# EAGLE board IoT_pj_schematic (EAGLE 9.6.1)
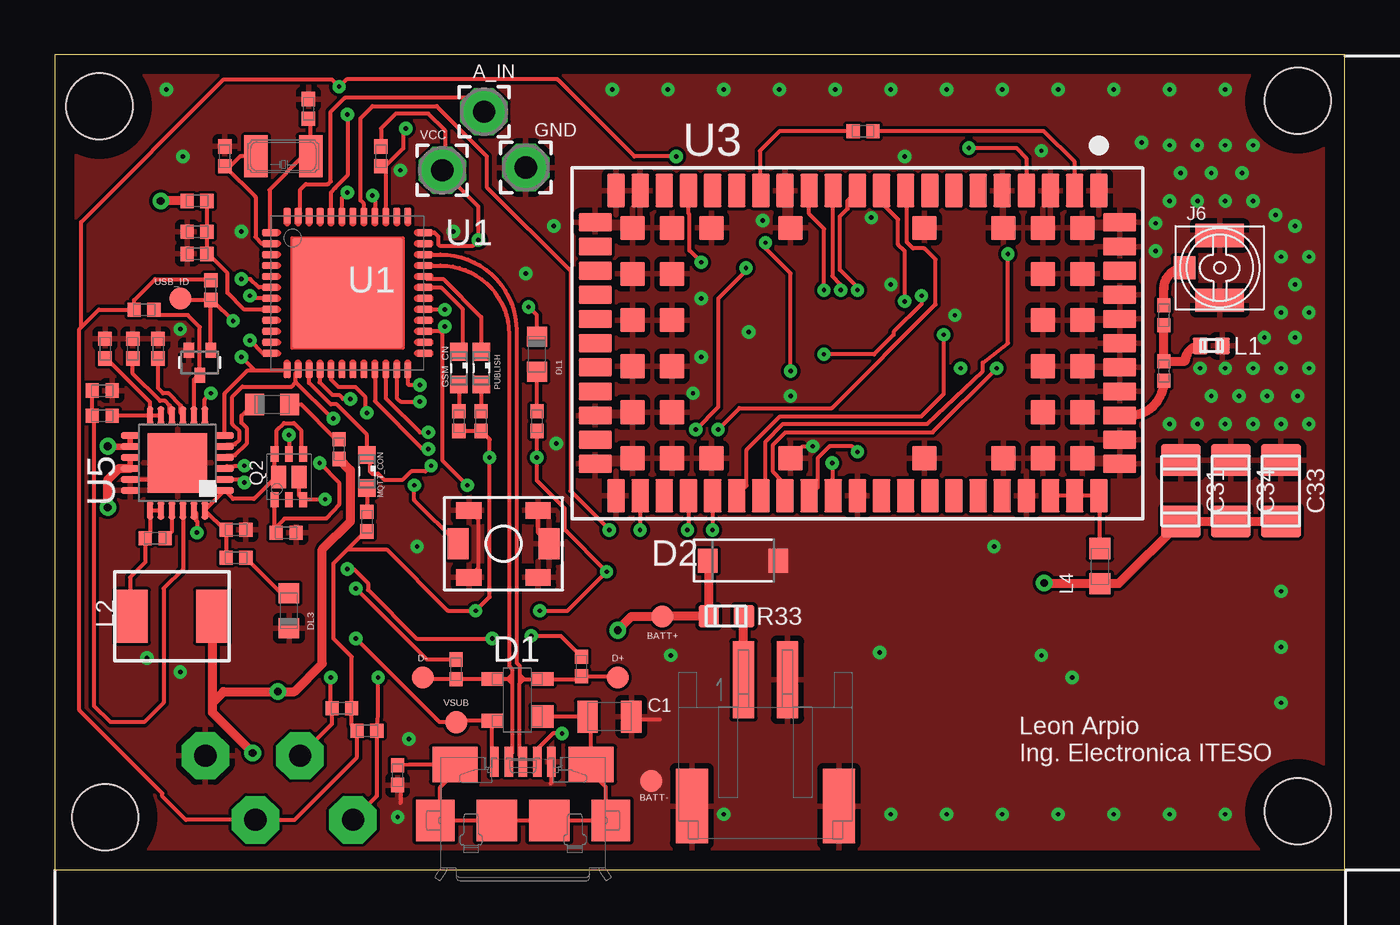
[diagram p2: board, top side]
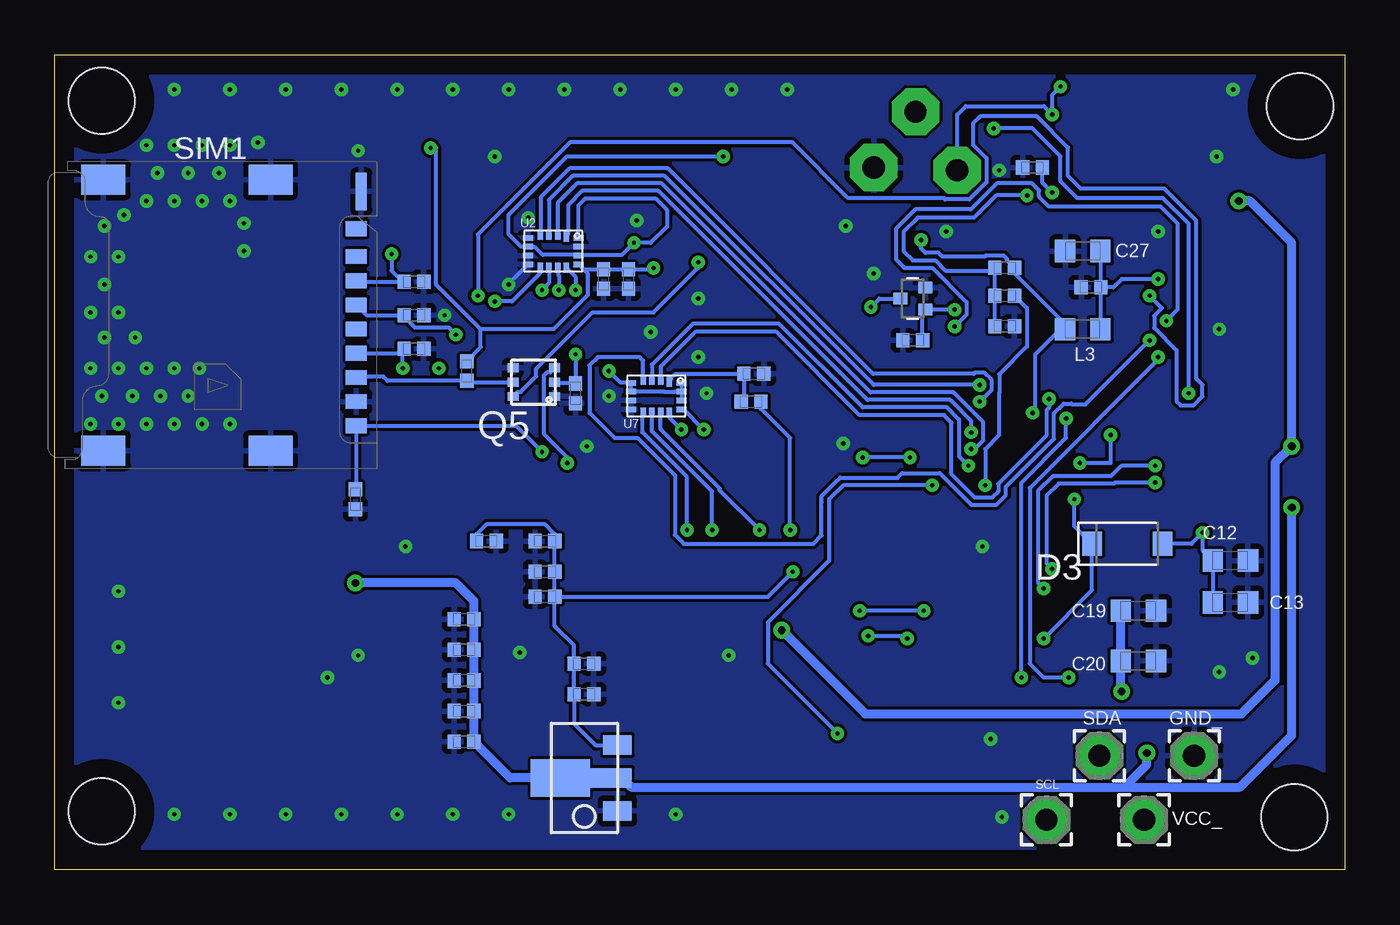
[diagram p3: board, bottom side, seen from below]

Size 58.78 x 37.13 mm. Coordinates in mm from the lower left corner, seen from the top.
Outline: 0,0 58.78,0 58.78,37.13 0,37.13 0,0
Copper layers (1*16): Top 0.035mm / dielectric 0.2mm / Bottom 0.035mm
Design rules "default *": minimum track width 6mil, minimum drill 0.195mm, track to track 5.5mil, track to pad 5.5mil, pad to pad 5.5mil, via to via 5.5mil, smd to smd 5.5mil, copper to edge 35mil, drill to drill 6mil, minimum pad ring 10mil, minimum via ring 8mil, stop-mask expansion 4mil, vias tented up to drill 0mil, thermal gap 10mil
Net classes: 0 default: width 0.19 mm, drill 0.19 mm; 1 usb: width 0.19 mm, drill 0.19 mm, clearance 0.127 mm
Holes 3 mm at 56.64,35.05 56.64,2.67 2.29,2.41 2.03,34.8

## Footprints (pad centres in the part's own frame; a part is rotated, then mirrored left to right if it is on the bottom)
2,15/1,0 = drill 1.016 pad 2.159 octagon: 1 0,0
TP-1.00MM = smd 1 x 1 bottom: X 0,0
0805-R2013X50N = smd 0.95 x 1.45: 1 -1,0; 2 1,0
0402-1005X55N = smd 0.62 x 0.62: 1 -0.45,0; 2 0.45,0
0603-1608X90N = smd 0.95 x 1: 1 -0.8,0; 2 0.8,0
C1206 = smd 1.45 x 1.8: 1 -1.4,0; 2 1.4,0
SOT190P230X110-4N = smd 1 x 1: 1 -1.15,0.75 | smd 1 x 0.6: 2 -1.15,-0.95; 3 1.15,-0.95; 4 1.15,0.95
SODFL3517X110N = smd 0.91 x 1.07: A 1.605,0; C -1.605,0
LEDC1608X80N-AK = smd 0.9 x 0.95: A 0.8,0; C -0.8,0
SML0603 = smd 0.8 x 0.8: A 0.75,0; C -0.75,0
ZX62-AB-5PA = smd 0.4 x 1.35: 1 -1.3,3.025; 2 -0.65,3.025; 3 0,3.025; 4 0.65,3.025; 5 1.3,3.025 | smd 2.1 x 1.6: 6 3.1,2.9; 11 -3.1,2.9 | smd 1.8 x 1.9: 7 4,0.35; 10 -4,0.35 | smd 1.9 x 1.9: 8 1.2,0.35; 9 -1.2,0.35
U.FL-R-SMT-1(60) = smd 1.05 x 2.2: GND1 -1.475,0; GND2 1.475,0 | smd 1.05 x 1: SIG 0,-1.6
JST-S2B-PH-SM4-TB = smd 1 x 3.5: 1 -1,2.95; 2 1,2.95 | smd 1.5 x 3.4: 3 3.35,-2.8; 4 -3.35,-2.8
C0402 = smd 0.7 x 0.75: 1 -0.5,0; 2 0.5,0
SRP4020 = smd 1.5 x 2.4: 1 -1.85,0; 2 1.85,0
C&K_PTS820_NO_HOLES = smd 1.15 x 0.75: 1 -1.575,1.525; 2 -1.575,-1.525; 3 1.575,1.525; 4 1.575,-1.525 | smd 0.95 x 1.4: 5 -2.075,0; 6 2.075,0
SOTFL50P160X78-3 = smd 0.5 x 0.66: D 0,0.57; G -0.5,-0.57; S 0.5,-0.57
SON65P205X205X75-8N-MWSD = smd 0.67 x 0.37: A 1.04,-0.65; D 1.04,0.65; G -1.04,0; K -1.04,-0.65; NC 1.04,0; S -1.04,0.65 | smd 1 x 0.7: D2 0,0.467; K2 0,-0.467
PWR_SC70-6L2 = smd 0.4 x 0.5: 1 -0.65,-0.95; 2 0,-0.95; 3 0.65,-0.95; 4 0.65,0.95; 5 0,0.95; 6 -0.65,0.95
C0603 = smd 0.95 x 1: 1 -0.8,0; 2 0.8,0
MICROSIM8 = smd 0.67 x 0.95: CLK -0.47,6.77; GND 3.93,6.77; IO -1.57,6.77; NC1 -2.67,6.77; NC2 -3.94,6.77; RST 1.73,6.77; SW 2.83,6.77; VCC 5.03,6.77; VPP 0.63,6.77 | smd 1.7 x 0.5: SH1 -5.64,6.995 | smd 1.35 x 2: SH2 -6.175,2.865; SH3 6.175,2.865; SH4 -6.175,-4.755; SH5 6.175,-4.755
QFN50P700X700X90-49XN-EPSQ515 = smd 0.65 x 0.28: 1 -3.525,2.75; 2 -3.525,2.25; 3 -3.525,1.75; 4 -3.525,1.25; 5 -3.525,0.75; 6 -3.525,0.25; 7 -3.525,-0.25; 8 -3.525,-0.75; 9 -3.525,-1.25; 10 -3.525,-1.75; 11 -3.525,-2.25; 12 -3.525,-2.75; 25 3.525,-2.75; 26 3.525,-2.25; 27 3.525,-1.75; 28 3.525,-1.25; 29 3.525,-0.75; 30 3.525,-0.25; 31 3.525,0.25; 32 3.525,0.75; 33 3.525,1.25; 34 3.525,1.75; 35 3.525,2.25; 36 3.525,2.75 | smd 0.28 x 0.65: 13 -2.75,-3.525; 14 -2.25,-3.525; 15 -1.75,-3.525; 16 -1.25,-3.525; 17 -0.75,-3.525; 18 -0.25,-3.525; 19 0.25,-3.525; 20 0.75,-3.525; 21 1.25,-3.525; 22 1.75,-3.525; 23 2.25,-3.525; 24 2.75,-3.525; 37 2.75,3.525; 38 2.25,3.525; 39 1.75,3.525; 40 1.25,3.525; 41 0.75,3.525; 42 0.25,3.525; 43 -0.25,3.525; 44 -0.75,3.525; 45 -1.25,3.525; 46 -1.75,3.525; 47 -2.25,3.525; 48 -2.75,3.525 | smd 5 x 5: 49 0,0
RSV = smd 0.25 x 0.55: 1 -0.6,-0.7 | smd 0.25 x 0.45: 2 -0.2,-0.75; 3 0.2,-0.75; 4 0.6,-0.75; 9 0.6,0.75; 10 0.2,0.75; 11 -0.2,0.75; 12 -0.6,0.75 | smd 0.45 x 0.25: 5 1.15,-0.6; 6 1.15,-0.2; 7 1.15,0.2; 8 1.15,0.6; 13 -1.15,0.6; 14 -1.15,0.2; 15 -1.15,-0.2; 16 -1.15,-0.6
SARA-96 = smd 1.5 x 0.8: 1 -6.95,11; 2 -6.95,9.9; 3 -6.95,8.8; 4 -6.95,7.7; 5 -6.95,6.6; 6 -6.95,5.5; 7 -6.95,4.4; 8 -6.95,3.3; 9 -6.95,2.2; 10 -6.95,1.1; 11 -6.95,0; 12 -6.95,-1.1; 13 -6.95,-2.2; 14 -6.95,-3.3; 15 -6.95,-4.4; 16 -6.95,-5.5; 17 -6.95,-6.6; 18 -6.95,-7.7; 19 -6.95,-8.8; 20 -6.95,-9.9; 21 -6.95,-11; 33 6.95,-11; 34 6.95,-9.9; 35 6.95,-8.8; 36 6.95,-7.7; 37 6.95,-6.6; 38 6.95,-5.5; 39 6.95,-4.4; 40 6.95,-3.3; 41 6.95,-2.2; 42 6.95,-1.1; 43 6.95,0; 44 6.95,1.1; 45 6.95,2.2; 46 6.95,3.3; 47 6.95,4.4; 48 6.95,5.5; 49 6.95,6.6; 50 6.95,7.7; 51 6.95,8.8; 52 6.95,9.9; 53 6.95,11 | smd 0.8 x 1.5: 22 -5.5,-11.95; 23 -4.4,-11.95; 24 -3.3,-11.95; 25 -2.2,-11.95; 26 -1.1,-11.95; 27 0,-11.95; 28 1.1,-11.95; 29 2.2,-11.95; 30 3.3,-11.95; 31 4.4,-11.95; 32 5.5,-11.95; 54 5.5,11.95; 55 4.4,11.95; 56 3.3,11.95; 57 2.2,11.95; 58 1.1,11.95; 59 0,11.95; 60 -1.1,11.95; 61 -2.2,11.95; 62 -3.3,11.95; 63 -4.4,11.95; 64 -5.5,11.95 | smd 1.1 x 1.1: 65 -5.25,10.25; 66 -3.15,10.25; 67 -1.05,10.25; 68 1.05,10.25; 69 3.15,10.25; 70 5.25,10.25; 71 -5.25,8.45; 72 -3.15,8.45; 73 -1.05,8.45; 74 1.05,8.45; 75 3.15,8.45; 76 5.25,8.45; 77 -5.25,6.65; 78 5.25,6.65; 79 -5.25,3.05; 80 5.25,3.05; 81 -5.25,-3.05; 82 5.25,-3.05; 83 -5.25,-6.65; 84 5.25,-6.65; 85 -5.25,-8.45; 86 -3.15,-8.45; 87 -1.05,-8.45; 88 1.05,-8.45; 89 3.15,-8.45; 90 5.25,-8.45; 91 -5.25,-10.25; 92 -3.15,-10.25; 93 -1.05,-10.25; 94 1.05,-10.25; 95 3.15,-10.25; 96 5.25,-10.25
QFN24 = smd 0.3 x 0.85: 1 1.25,2.155; 2 0.75,2.155; 3 0.25,2.155; 4 -0.25,2.155; 5 -0.75,2.155; 6 -1.25,2.155; 13 -1.25,-2.155; 14 -0.75,-2.155; 15 -0.25,-2.155; 16 0.25,-2.155; 17 0.75,-2.155; 18 1.25,-2.155 | smd 0.85 x 0.3: 7 -2.155,1.25; 8 -2.155,0.75; 9 -2.155,0.25; 10 -2.155,-0.25; 11 -2.155,-0.75; 12 -2.155,-1.25; 19 2.155,-1.25; 20 2.155,-0.75; 21 2.155,-0.25; 22 2.155,0.25; 23 2.155,0.75; 24 2.155,1.25 | smd 2.7 x 2.7: 25 0,0
SOT89-3L = smd 0.9 x 1.3: 1 -1.5,0; 3 1.5,0 | smd 0.9 x 1.9: 2 0,0.3 | smd 1.7 x 2.7: TH 0,2.6
ABS07 = smd 1.1 x 1.9: 1 -1.25,0; 2 1.25,0

## Placement (x,y rotation side)
A_IN  [2,15/1,0]  19.56,34.54 0 top
BATT+  DNP  [TP-1.00MM]  27.69,11.56 0 bottom
BATT-  DNP  [TP-1.00MM]  27.18,4.06 0 bottom
C1  4n7  [0805-R2013X50N]  25.27,6.99 0 top
C2  100n  [0402-1005X55N]  15.49,24.77 0 bottom
C3  20p  [0402-1005X55N]  11.56,34.67 270 top
C4  20p  [0402-1005X55N]  7.75,32.51 270 top
C6  100n  [0402-1005X55N]  6.48,28.07 180 top
C8  100n  [0402-1005X55N]  36.45,12.45 0 bottom
C9  100n  [0402-1005X55N]  33.78,26.92 270 bottom
C10  15p  [0402-1005X55N]  50.55,22.73 90 top
C11  33p  [0402-1005X55N]  50.55,25.27 90 top
C12  10u  [0603-1608X90N]  5.21,14.1 0 bottom
C13  10u  [0603-1608X90N]  5.21,12.19 0 bottom
C14  1u  [0402-1005X55N]  8.26,15.49 0 top
C15  47n  [0402-1005X55N]  4.57,15.11 180 top
C16  4u7  [0402-1005X55N]  2.16,21.84 0 top
C17  100n  [0402-1005X55N]  34.67,8 0 bottom
C18  100n  [0402-1005X55N]  34.67,9.4 0 bottom
C19  10u  [0603-1608X90N]  9.4,11.81 0 bottom
C20  10u  [0603-1608X90N]  9.4,9.53 0 bottom
C22  1u  [0402-1005X55N]  40.13,7.24 180 bottom
C23  100n  [0402-1005X55N]  11.56,26.54 180 bottom
C24  100n  [0402-1005X55N]  39.12,14.99 0 bottom
C25  1u  [0402-1005X55N]  14.22,32 180 bottom
C26  1u  [0402-1005X55N]  36.45,14.99 180 bottom
C27  4u7  [0603-1608X90N]  11.94,28.19 180 bottom
C28  10n  [0402-1005X55N]  40.13,8.64 180 bottom
C29  100n  [0402-1005X55N]  40.13,11.43 180 bottom
C30  15p  [0402-1005X55N]  40.13,5.84 180 bottom
C31  100uF  [C1206]  51.31,17.27 90 top
C32  100n  [0402-1005X55N]  45.09,16.89 90 bottom
C33  100uF  [C1206]  55.88,17.27 90 top
C34  100uF  [C1206]  53.59,17.27 90 top
C35  100n  [0402-1005X55N]  36.45,13.59 0 bottom
C36  100n  [0402-1005X55N]  32.64,26.92 270 bottom
C37  56p  [0402-1005X55N]  40.13,10.03 180 bottom
D1  PRTR5V  [SOT190P230X110-4N]  21.08,7.75 180 top
D2  PMEG6020  [SODFL3517X110N]  31.37,14.1 0 top
D3  PMEG6020  [SODFL3517X110N]  9.91,14.86 0 bottom
D4  PESD0402  [0402-1005X55N]  42.42,23.75 180 bottom
D5  PESD0402  [0402-1005X55N]  42.42,25.27 180 bottom
D6  PESD0402  [0402-1005X55N]  42.42,26.8 180 bottom
D+  DNP  [TP-1.00MM]  25.65,8.76 0 bottom
D-  DNP  [TP-1.00MM]  16.76,8.76 0 bottom
DL1  YELLOW  [LEDC1608X80N-AK]  21.97,23.5 270 top
DL2  ORANGE  [LEDC1608X80N-AK]  9.91,21.21 0 top
DL3  GREEN  [LEDC1608X80N-AK]  10.67,11.81 90 top
GND  [2,15/1,0]  21.46,32 0 top
GND_  [2,15/1,0]  6.86,5.21 0 bottom
GSM_CN  [SML0603]  18.41,22.86 270 top
J1  -  [ZX62-AB-5PA]  21.34,1.91 0 top
J6  -  [U.FL-R-SMT-1(60)]  53.09,27.43 270 top
J7  -  [JST-S2B-PH-SM4-TB]  32.38,5.71 0 top
L1  39nH  [C0402]  52.7,23.88 180 top
L2  2u2  [SRP4020]  5.33,11.56 0 top
L3  BLM18PG471  [0603-1608X90N]  11.94,24.64 0 bottom
L4  BLM18EG221  [0603-1608X90N]  47.62,13.84 90 top
MQTT_CON  [SML0603]  14.22,18.16 270 top
PB1  PTS820  [C&K_PTS820_NO_HOLES]  20.45,14.86 180 top
PUBLISH  [SML0603]  19.43,22.86 270 top
Q1  2N7002  [SOTFL50P160X78-3]  19.68,26.04 90 bottom
Q2  SIA817  [SON65P205X205X75-8N-MWSD]  10.67,17.91 270 top
Q3  2N7002  [SOTFL50P160X78-3]  6.6,23.11 180 top
Q5  2N7002DW-7-FNO_PAD  [PWR_SC70-6L2]  36.96,22.23 90 bottom
R1  1M  [0402-1005X55N]  15.62,4.32 90 top
R2  1k  [0402-1005X55N]  19.43,20.45 90 top
R3  330R  [0402-1005X55N]  15.49,26.16 180 bottom
R4  1k  [0402-1005X55N]  14.22,15.88 90 top
R5  10k  [0402-1005X55N]  15.49,27.43 0 bottom
R6  1k  [0402-1005X55N]  18.41,20.45 90 top
R7  DNP  [0402-1005X55N]  24,9.27 90 top
R8  330k  [0402-1005X55N]  6.48,30.48 180 top
R9  1M2  [0402-1005X55N]  6.48,29.08 0 top
R10  100k  [0402-1005X55N]  35.05,21.72 90 bottom
R11  0R  [0402-1005X55N]  27.05,21.34 0 bottom
R12  100k  [0402-1005X55N]  36.83,33.66 0 top
R13  4k7  [0402-1005X55N]  14.22,6.35 180 top
R14  4k7  [0402-1005X55N]  13.08,7.37 0 top
R15  330R  [0402-1005X55N]  21.97,20.45 90 top
R16  100k  [0402-1005X55N]  19.68,24.13 0 bottom
R17  DNP  [0402-1005X55N]  18.29,9.14 90 top
R18  DNP  [0402-1005X55N]  26.92,22.61 180 bottom
R19  100k  [0402-1005X55N]  10.54,15.37 180 top
R21  10k  [0402-1005X55N]  7.11,26.42 270 top
R23  330R  [0402-1005X55N]  12.95,19.18 270 top
R24  10k  [0402-1005X55N]  14.86,32.51 270 top
R25  10k  [0402-1005X55N]  4.7,23.75 270 top
R26  10k  [0402-1005X55N]  4.06,25.53 0 top
R27  390R  [0402-1005X55N]  8.26,14.22 180 top
R28  220R  [0402-1005X55N]  3.56,23.75 90 top
R29  10k  [0402-1005X55N]  2.29,23.75 270 top
R30  5k49  [0402-1005X55N]  2.16,20.7 0 top
R31  10k  [0402-1005X55N]  40.01,22.73 90 bottom
R33  0R  [C0603]  30.61,11.56 180 top
SCL  [2,15/1,0]  13.59,2.29 0 bottom
SDA  [2,15/1,0]  11.18,5.21 0 bottom
SIM1  -  [MICROSIM8]  51.82,25.27 270 bottom
U1  D21G18  [QFN50P700X700X90-49XN-EPSQ515]  13.34,26.29 0 top
U2  SN74AVC4T774  [RSV]  36.07,28.19 180 bottom
U3  SARA-U201  [SARA-96]  36.58,24 270 top
U5  BQ24195L  [QFN24]  5.59,18.54 270 top
U6  AP721533  [SOT89-3L]  33.15,4.19 90 bottom
U7  SN74AVC4T774  [RSV]  31.37,21.59 180 bottom
USB_ID  DNP  [TP-1.00MM]  5.71,26.04 0 bottom
VCC  [2,15/1,0]  17.65,31.88 0 top
VCC_  [2,15/1,0]  9.14,2.29 0 bottom
VSUB  DNP  [TP-1.00MM]  18.29,6.73 0 bottom
Y1  32768Hz  [ABS07]  10.41,32.51 0 top

## Tracks (layer width: path | path; a pad name or v marks a point on that pad's centre or on a via)
+1V8  (via drill 0.2)
  Top 0.19: v31.5,27.43 31.5,27.3 30.23,26.04 30.23,21.08 v29.21,20.07 | v41.66,32.89 43.81,32.89 44.28,32.43 U3.4
  Bottom 0.19: v31.5,27.43 31.55,27.37 C36.1 C9.1 34.7,27.37 U2.13 34.5,27.18 34.5,26.19 36.05,24.64 39.37,24.64 | v29.21,20.07 30.13,20.99 U7.13 | 39.37,24.64 41.4,26.67 41.4,32.89 v41.66,32.89 | R31.2 39.37,23.82 39.37,24.64
+3V3  (via drill 0.2)
  Top 0.19: R4.1 14.15,15.43 13.34,14.61 | 13.34,14.61 12.7,13.97 12.7,10.54 13.53,9.71 R14.2 13.53,6.59 R13.2 13.77,5.14 10.92,2.29 VCC_.1 5.97,2.29 4.9,3.36 4.9,3.5 1.11,7.28 1.11,24.64 1.19,24.72 | 13.34,14.61 15.11,14.61 17.91,11.81 v19.18,11.81 19.81,12.45 v19.81,18.8 19.81,19.62 R2.1 R6.1 | R15.1 v21.97,18.8 21.97,17.73 23.24,16.46 23.24,15.49 v25.15,13.59 23.37,11.81 v22.1,11.81 | R21.1 7.05,26.92 4.57,26.92 3.61,25.97 R26.1 2,25.53 1.19,24.72 | R24.1 14.86,33.78 15.53,34.46 17.02,34.46 17.78,33.69 17.78,32 VCC.1 19.3,30.23 v19.3,28.7 19.05,28.45 17.53,28.45 17.47,28.5 17.47,28.87 17.3,29.04 U1.36 | v13.34,34.42 13.34,31.64 12.78,31.09 12.78,31.07 12.57,30.86 12.57,29.83 U1.44 | 1.19,24.72 1.19,29.51 7.7,36.02 12.62,36.02 v12.95,35.69 13.29,36.02 22.9,36.02 26.42,32.51 v28.32,32.51 | v33.53,22.73 33.53,27.18 32.38,28.32 v32.38,28.57 | U1.17 12.59,22.34 12.91,22.01 13.69,22.01 14.14,21.56 14.14,20.83 v14.22,20.83
  Bottom 0.19: C8.2 36,11.11 35.12,10.23 C18.1 C17.1 35.12,6.67 34.14,5.69 U6.3 | C8.2 C35.2 C26.1 36,15.3 36.45,15.75 39.12,15.75 39.57,15.3 C24.1 | C8.2 26.29,12.45 v25.15,13.59 | U7.16 U7.15 | U7.15 U7.14 | U7.15 30.52,21.79 30.54,21.77 31,21.77 31.02,21.79 U7.6 U7.5 32.55,22.23 33.02,22.23 v33.53,22.73 | 34.89,28.77 U2.16 34.92,30.28 34.6,30.6 31.41,30.6 30.89,30.07 30.89,29.31 31.62,28.57 v32.38,28.57 32.94,28.02 34.89,28.02 U2.14 34.95,28.02 36.55,28.02 36.89,28.37 37.19,28.37 U2.6 37.54,28.39 38.1,28.96 38.1,29.84 35.43,32.51 v28.32,32.51 | v19.81,18.8 v21.97,18.8 | VCC.1 17.65,34.42 17.27,34.8 13.72,34.8 v13.34,34.42 13.34,35.31 v12.95,35.69 | v19.18,11.81 v22.1,11.81 | v14.22,20.83 14.1,20.95 14.1,23.5 12.95,24.64 L3.1 12.74,24.87 15.04,27.18 R5.2 15.39,27.77 15.39,27.84 15.54,27.99 16.35,27.99 16.4,27.94 18.34,27.94 18.51,28.12 19.1,28.12 19.3,28.32 v19.3,28.7
+3V8  (via drill 0.35)
  Top 0.19: 45.12,13.04 v45.09,13.08 | U5.16
  Top 0.254: U5.16 U5.15
  Top 0.406: C33.1 C34.1 C31.1 48.48,13.04 L4.1 45.12,13.04 | v9.02,5.33 7.18,7.17 7.18,7.62 | 7.18,7.62 L2.2 | U5.16 2.93,18.3 2.41,17.78 v2.41,16.51 | 7.18,7.62 7.69,8.13 v10.16,8.13 10.92,8.13 12.19,9.4 12.19,14.61 13.46,15.88 13.46,18.22 R23.2
  Bottom 0.406: v45.09,13.08 40.51,13.08 39.68,12.25 C29.1 C37.1 C28.1 C22.1 C30.1 38.03,4.19 U6.TH U6.2 32.94,4.19 32.52,3.77 10.03,3.77 | 10.03,3.77 4.77,3.77 2.41,6.13 v2.41,16.51 | 10.03,3.77 9.02,4.79 v9.02,5.33 | v10.16,8.13 10.2,8.17 C20.1 C19.1
+5V  (via drill 0.2)
  Top 0.19: Q2.D2 11.13,17.05 Q2.D 12.29,16.87 v12.32,16.89 | J1.1 19.93,5.03 D1.4 18.35,6.8 VSUB.X 17.54,6.73 13.73,10.54 v13.72,10.54
  Bottom 0.19: v13.72,10.54 11.51,12.75 D3.C 12.32,15.67 v12.32,16.89
GND  (via drill 0.2)
  Top 0.19: C1.2 26.4,6.86 27.56,6.86 | R1.1 15.75,3.74 15.75,3.05 | PB1.5 22.02,15.36 PB1.2 | PB1.3 19.3,13.77 19.3,15.95 PB1.4 | U5.17 4.84,17.79 U5.25 | U3.82 34.08,19.3 v34.54,19.3 | J1.5 22.64,3.97 22.61,3.94
  Bottom 0.19: U2.8 38.1,26.71 v38.1,26.67
  other vias: 50.8,20.32 52.07,20.32 53.34,20.32 54.61,20.32 55.88,20.32 57.15,20.32 52.7,21.59 53.98,21.59 55.24,21.59 56.64,21.59 52.2,22.86 53.34,22.86 54.61,22.86 55.88,22.86 57.15,22.86 55.12,24.26 56.52,24.26 57.15,25.4 55.88,25.4 56.52,26.67 57.15,27.94 55.88,27.94 56.52,29.34 55.63,29.84 54.61,30.48 50.16,28.19 50.16,29.46 53.34,30.48 52.07,30.48 50.8,30.48 54.1,31.75 52.7,31.75 51.31,31.75 54.61,33.02 53.34,33.02 52.07,33.02 50.8,33.02 49.53,33.15 15.62,2.41 5.71,24.64 5.84,32.51 46.35,8.76 32.26,29.59 38.73,32.51 21.46,27.18 5.71,9.02 31.62,24.51 33.53,21.59 42.8,14.73 29.46,26.04 28.07,9.78 16.51,14.73 4.19,9.65 16.13,5.97 44.96,32.77 8.51,29.08 41.02,25.27 29.08,21.72 22.86,19.43 37.21,29.72 15.75,31.88 18.16,29.08 22.73,29.34 37.59,9.91 29.46,23.37 44.96,9.78 5.08,35.56 25.4,35.56 27.94,35.56 30.48,35.56 33.02,35.56 35.56,35.56 38.1,35.56 40.64,35.56 43.18,35.56 45.72,35.56 48.26,35.56 50.8,35.56 53.34,35.56 55.88,12.7 55.88,10.16 55.88,7.62 53.34,2.54 50.8,2.54 48.26,2.54 45.72,2.54 43.18,2.54 40.64,2.54 38.1,2.54 30.48,2.54
  pour Top: 0,0 58.8,0 58.8,37.08 0.13,37.08 0,37.08
  pour Bottom: 58.8,37.08 58.8,0 0,0 0,37.08
MCTS  (via drill 0.2)
  Top 0.19: v36.58,26.42 36.58,26.54 35.77,27.34 35.77,29.78 36.12,30.12 36.12,30.5 U3.11
  Bottom 0.19: U2.10 36.27,26.74 36.37,26.64 36.37,26.63 v36.58,26.42
MDTR  (via drill 0.2)
  Top 0.19: v30.23,20.07 31.2,21.04 35.41,21.04 40.13,25.76 40.13,27.81 39.62,28.32 39.12,28.32 38.83,28.61 38.83,30.9 U3.9
  Bottom 0.19: U7.12 30.77,20.61 v30.23,20.07
MI2SCLK  (via drill 0.2)
  Top 0.19: U3.36 28.88,15.54 v28.83,15.49
  Bottom 0.19: v28.83,15.49 28.83,17.25 31.57,19.99 U7.10
MI2SFS  (via drill 0.2)
  Top 0.19: U3.34 v26.68,15.5 v26.67,15.49
  Bottom 0.19: v26.67,15.49 28.49,17.31 28.49,17.39 31.17,20.07 U7.11
MI2SRX  (via drill 0.2)
  Top 0.19: U3.37 v29.98,15.5 v29.97,15.49
  Bottom 0.19: v29.97,15.49 29.97,17.91 32,19.94 32,20.8 U7.9
MRST  (via drill 0.2)
  Top 0.19: U3.18 28.88,29.92 28.92,29.87 28.92,28.23 v29.46,27.69
  Bottom 0.19: Q5.6 37.7,21.78 37.55,21.78 36.85,22.48 36.85,22.84 34.28,25.4 31.5,25.4 29.46,27.43 v29.46,27.69
MRTS  (via drill 0.2)
  Top 0.19: U3.10 37.72,30.91 37.72,30.35 38.43,29.64 38.43,28.5 38.73,28.19 v38.73,25.91
  Bottom 0.19: U2.9 36.67,27.19 37.95,25.91 v38.73,25.91
MRX  (via drill 0.2)
  Top 0.19: v35.05,26.42 35.05,29.21 34.38,29.89 U3.13
  Bottom 0.19: U2.12 35.05,27.03 v35.05,26.42
MTX  (via drill 0.2)
  Top 0.19: v35.81,26.42 35.81,26.67 35.43,27.05 35.43,30.91 U3.12
  Bottom 0.19: U2.11 35.84,27.42 35.84,27.12 35.81,27.09 v35.81,26.42
N17658775  (via drill 0.2)
  Top 0.19: PB1.6 16.38,16.85 v16.38,17.53
  Bottom 0.19: v16.38,17.53 16.38,19.18 15.75,19.81 15.75,21.72 15.74,21.73 15.74,22.59 14.48,23.86 14.48,25.6 R3.1
N17798864
  Top 0.19: DL2.A 11.21,21.21 12.8,19.63 R23.1
N17834267
  Top 0.19: R27.1 10.32,12.61 DL3.A
N17852357  (via drill 0.2)
  Top 0.19: U1.6 9.29,26.54 8.91,26.92 v8.51,26.92
  Bottom 0.19: v8.51,26.92 10.16,26.92 10.54,26.54 C23.1 | L3.2 11.11,24.67 C23.1 | C23.1 11.11,28.16 C27.1
N17852431  (via drill 0.2)
  Top 0.19: U1.43 13.09,30.61 v13.34,30.86
  Bottom 0.19: v13.34,30.86 13.77,31.3 C25.1
N$1
  Top 0.19: D1.1 22.24,6.99 C1.1 24.44,6.82 J1.6 24.44,4.45 25.11,3.77 25.11,2.48 J1.7 J1.8 J1.9 J1.10 17.56,2.48 17.56,3.77 18.24,4.45 J1.11 16.16,4.8 R1.2
N$2
  Top 0.19: GSM_CN.A R6.2
N$3
  Top 0.406: J7.1 31.39,11.54 R33.1
N$4
  Top 0.19: PUBLISH.A R2.2
N$5
  Top 0.406: U3.56 arc90 48.97,20.7 arc90 C10.1
N$6
  Top 0.19: R8.1 R9.2 C6.1 6.99,28.07 7.87,27.18 7.87,26.29 8.64,25.53 9.8,25.53 U1.8
N$7
  Top 0.19: R15.2 DL1.A
N$8
  Top 0.406: C11.2 50.55,26.49 arc-90 J6.SIG
N$9
  Bottom 0.19: U7.1 30.69,22.37 30.69,22.42 30.5,22.61 R18.2 27.37,21.46 R11.1
N$10  (via drill 0.2)
  Top 0.19: DL1.C 21.97,25.27 v21.59,25.65
  Bottom 0.19: v21.59,25.65 21.21,26.04 Q1.D
N$11  (via drill 0.2)
  Top 0.19: v35.43,18.54 35.43,17.78 35.43,17.65 35.43,17.1 U3.42
  Bottom 0.19: Q5.3 36.21,22.67 36.36,22.67 36.5,22.53 36.5,19.88 35.43,18.8 v35.43,18.54
N$12
  Top 0.19: L4.2 47.62,17 U3.53 U3.52 U3.51
N$13
  Top 0.19: U3.15 32.13,31 32.13,32.77 33.02,33.66 R12.1
N$14
  Top 0.406: C11.1 C10.2 51.51,23.18 arc-90 L1.2
N$15
  Top 0.19: U5.20 U5.19 4.34,15.33 C15.2 4.12,14.03 3.43,13.34 3.43,11.61 L2.1
N$16  (via drill 0.2)
  Top 0.19: U5.2 8.5,17.79 v8.64,17.65 | v13.34,13.72 13.61,13.72 14.27,13.05 14.27,12.76 16.49,10.54 v19.94,10.54 | v21.72,10.67 23.06,10.67 R7.2
  Bottom 0.19: v8.64,17.65 10.46,17.65 10.51,17.6 13.03,17.6 13.59,17.04 13.59,13.97 v13.34,13.72 | v21.72,10.67 20.07,10.67 v19.94,10.54
N$17
  Top 0.19: R27.2 C14.1 7.73,15.49 U5.24 U5.1 8.12,16.91 9.08,16.91 10.07,17.91 Q2.K2 10.02,18.09 Q2.K 10.12,19.05 10.12,20.04 10.44,20.36 10.9,20.36 11.22,20.04 11.22,19.05 Q2.S
N$18
  Top 0.19: C15.1 5.34,15.43 U5.21
N$19
  Top 0.19: U5.10 5.24,20.8 5.24,21.16 5.03,21.37 4.79,21.37 3.56,22.61 R28.1
N$20  (via drill 0.2)
  Top 0.19: U5.3 7.85,18.39 8.21,18.39 8.22,18.41 v8.64,18.41 | v13.72,12.83 16.95,9.59 R17.2
  Bottom 0.19: v8.64,18.41 10.18,18.41 10.65,17.95 13.3,17.95 13.97,17.27 13.97,13.08 v13.72,12.83
N$21
  Top 0.19: C16.1 R30.1 1.78,20.63 1.78,7.49 2.54,6.73 4.06,6.73 4.95,7.62 4.95,12.83 5.84,13.71 U5.22
N$22
  Top 0.19: U5.8 6.34,22.34 6.54,22.54 Q3.D 6.6,24.73 6.05,25.27 4.77,25.27 R26.2
N$23
  Top 0.19: U5.11 U5.12 | U5.12 R30.2 | U5.12 4.34,21.32 2.35,23.3 R29.2
N$24
  Top 0.19: U5.9 5.74,20.8 5.74,21.16 5.18,21.71 4.93,21.71 4.7,21.95 R25.2
N$25
  Top 0.19: MQTT_CON.A R4.2
N$26  (via drill 0.2)
  other vias: 41.27,22.86
PA00_XIN32
  Top 0.19: C3.2 11.66,34.11 Y1.2 11.3,32.51 9.78,30.99 9.78,29.07 U1.1
PA01_XOUT32
  Top 0.19: Y1.1 8.45,32.51 8,32.06 C4.2 9.14,30.66 9.14,28.83 9.43,28.54 U1.2
PA07_AIN7  (via drill 0.2)
  Top 0.19: v8.89,24.13 9.48,23.54 U1.12
  Bottom 0.19: U7.4 31.97,23.21 32.13,23.37 34.04,23.37 34.42,22.99 34.42,20.83 33.27,19.68 32.23,19.68 30.52,17.97 30.52,15.27 30.12,14.86 24.22,14.86 23.84,15.24 23.84,16.75 23.84,16.89 23.84,17.03 23.84,17.04 23.74,17.14 23.64,17.23 23.63,17.23 23.08,17.77 22.98,17.87 22.84,17.87 20.38,17.87 20.17,18.08 18.45,18.08 17.01,16.63 15.88,16.63 15.44,17.07 15.44,17.45 13.25,19.64 13.25,20.8 12.8,21.25 12.47,21.25 12.43,21.21 11.81,21.21 v8.89,24.13
PA08_S0_I2C_SDA  (via drill 0.2)
  Top 0.19: U5.6 7.74,21.71 8.79,22.76 9.11,22.76 | 9.11,22.76 U1.13 | SDA.1 12.63,6.66 R14.1 12.57,7.42 v12.57,8.76 | v8.51,23.37 9.11,22.76
  Bottom 0.19: v12.57,8.76 13.72,8.76 14.35,9.4 14.35,17.4 8.51,23.24 v8.51,23.37
PA09_S0_I2C_SCL  (via drill 0.2)
  Top 0.19: U5.5 7.85,19.39 8.21,19.39 8.41,19.61 8.41,19.98 8.09,20.31 8.09,21.57 8.54,22.03 10.79,22.03 10.98,22.22 10.98,22.23 | U1.14 10.98,22.66 10.98,22.23 | SCL.1 14.66,3.36 14.67,3.36 R13.1 14.73,7.04 v14.73,8.76 | v12.7,20.57 12.63,20.57 10.98,22.23
  Bottom 0.19: v14.73,8.76 14.73,17.65 12.7,19.68 v12.7,20.57
PA10_TCC0-W2  (via drill 0.2)
  Top 0.19: U1.15 11.59,22.2 12.57,21.21 12.84,21.21 14.22,19.83 MQTT_CON.C | 14.45,18.95 14.49,18.91 MQTT_CON.C | v17.14,18.41 16.89,18.16 16.24,18.16 15.86,17.78 15.01,17.78 14.73,18.06 14.45,18.06 14.35,18.16 14.35,18.78 MQTT_CON.C
  Bottom 0.19: v17.14,18.41 17.57,18.84 17.57,20.52 18.12,21.07 21.96,21.07 25.78,24.89 29.7,24.89 31.57,23.02 U7.3
PA11_TCC0-W3  (via drill 0.2)
  Top 0.19: v13.46,21.46 13.13,21.46 12.95,21.64 12.64,21.64 12.06,22.22 12.06,22.74 U1.16
  Bottom 0.19: U7.2 31.17,22.94 29.59,24.51 25.88,24.51 22.1,20.73 18.26,20.73 17.91,20.38 17.91,18.02 16.86,16.98 16.05,16.98 15.79,17.23 15.79,17.59 14.47,18.91 13.59,19.78 13.59,20.94 13.46,21.07 v13.46,21.46
PA12_S2_TX  (via drill 0.2)
  Top 0.19: U1.21 14.59,21.36 16.76,19.18 v17.02,19.18
  Bottom 0.19: v17.02,19.18 16.95,19.11 16.47,19.58 16.47,20.39 17.84,21.76 21.61,21.76 31.13,31.28 34.97,31.28 35.87,30.39 U2.2
PA13_S2_RX  (via drill 0.2)
  Top 0.19: U1.22 15.09,21.49 16.64,19.94 v17.02,19.94
  Bottom 0.19: v17.02,19.94 17.02,20.45 17.98,21.41 21.75,21.41 31.27,30.94 34.74,30.94 35.39,30.29 35.39,28.97 U2.1
PA14_S2_RTS  (via drill 0.2)
  Top 0.19: U1.23 15.59,21.5 15.75,21.34 v16.64,21.34
  Bottom 0.19: v16.64,21.34 16.43,21.55 16.41,21.55 16.09,21.87 16.09,22.33 16.41,22.65 16.86,22.65 16.91,22.61 21.49,22.61 30.85,31.96 35.32,31.96 36.64,30.65 36.64,28.97 U2.4
PA15_S2_CTS  (via drill 0.2)
  Top 0.19: U1.24 16.09,22.14 16.13,22.1 v16.64,22.1
  Bottom 0.19: v16.64,22.1 21.46,22.1 30.99,31.62 35.18,31.62 36.27,30.53 U2.3
PA18_OTG  (via drill 0.2)
  Top 0.19: Q3.G 7.1,25.96 R21.2 | USB_ID.X 5.78,25.97 R21.2 | R21.2 7.18,25.97 v8.13,25.02 | U1.27 17.55,24.54 v17.78,24.77 17.65,24.64 17.65,18.67 v18.8,17.53 | v23.11,6.22 22.71,6.22 21.99,5.5 J1.4
  Bottom 0.19: v8.13,25.02 7.62,25.53 7.62,29.46 8.38,30.23 13.48,30.23 13.93,30.68 13.93,30.96 14.25,31.29 15.85,31.29 17.04,30.1 19.56,30.1 20.45,29.21 20.45,27.81 20.07,27.43 18.8,27.43 17.23,25.86 17.23,25.3 17.55,24.98 17.57,24.98 v17.78,24.77 | v23.11,6.22 26.29,9.4 26.29,11.29 23.5,14.08 23.5,16.89 22.84,17.53 v18.8,17.53
PA20_TCC0-W6  (via drill 0.2)
  Top 0.19: U1.29 17.77,25.54 v17.78,25.53
  Bottom 0.19: v17.78,25.53 19.11,25.53 | 19.11,25.53 Q1.G | R16.2 19.23,25.4 19.11,25.53
PA22_TC4-W0
  Top 0.19: U1.31 17.6,26.54 18.57,25.56 18.57,23.77 GSM_CN.C
PA23_TC4-W1
  Top 0.19: U1.32 16.96,26.93 17.68,26.93 19.43,25.19 PUBLISH.C
PA27_INT  (via drill 0.2)
  Top 0.19: R24.2 14.96,31.96 15.88,32.88 15.88,33.66 v16,33.78 | 15.09,31.96 U1.39 | U5.7 6.84,21.44 v7.11,21.72
  Bottom 0.19: v7.11,21.72 7.11,29.44 8.28,30.61 12.19,30.61 12.95,31.37 12.95,32.51 14.22,33.78 v16,33.78
PA28_S2_DTR  (via drill 0.2)
  Top 0.19: U1.41 14.09,30.35 13.93,30.51 13.93,34.25 14.48,34.8 17.4,34.8 19.68,32.51 19.68,31.11 23.5,27.3 23.5,17.27 v25.27,15.49
  Bottom 0.19: v25.27,15.49 25.27,19.68 26.6,21.01 R11.2
PB02_AIN10
  Top 0.19: U1.47 11.19,29.92 11.19,30.99 11.44,31.24 12.45,31.24 12.57,31.37 12.57,34.54 13.21,35.18 18.92,35.18 A_IN.1
PB08_RST  (via drill 0.2)
  Top 0.19: v39.5,26.16 39.5,25.78 38.23,24.51 38.23,24.38 37.34,23.5 v35.05,23.5 | U1.7 9.01,26.04 v8.89,26.16
  Bottom 0.19: v8.89,26.16 8.33,25.6 8.68,25.25 8.68,24.7 7.66,23.68 7.66,21.36 7.47,21.17 6.88,21.17 6.48,21.57 6.48,22.1 6.77,22.39 6.77,29.58 8.22,31.04 12.03,31.04 12.61,31.62 12.61,32.91 14.04,34.33 16.61,34.33 16.93,34.01 16.93,33.03 16.33,32.43 16.33,31.33 17.1,30.55 18.2,30.55 18.26,30.61 22.63,30.61 25.17,33.15 35.31,33.15 39.5,28.96 v39.5,26.16 | v35.05,23.5 R10.2 35.95,22.17 Q5.2
RESETN  (via drill 0.2)
  Top 0.19: v14.48,30.73 14.59,30.63 U1.40
  Bottom 0.19: C2.1 R3.2 15.94,27.3 | 15.94,27.3 R5.1 | v14.48,30.73 15.88,30.73 16.89,29.72 19.45,29.72 20.11,29.07 20.11,28.19 19.68,27.77 18.65,27.77 18.18,27.3 15.94,27.3
SCLK  (via drill 0.2)
  Top 0.19: U3.38 31.53,17.51 31.53,19.14 33.05,20.66 39.48,20.66 40.51,21.69 v40.51,24.38
  Bottom 0.19: SIM1.CLK 44.58,25.27 42.93,25.27 | 42.93,25.27 D5.2 | v40.51,24.38 40.84,24.72 42.38,24.72 42.52,24.87 42.93,25.27
SIO  (via drill 0.2)
  Top 0.19: U3.39 32.39,17.26 32.39,19.52 33.19,20.32 39.76,20.32 42.29,22.73 42.29,23.11 43.43,24 v43.43,28.07
  Bottom 0.19: SIM1.IO 45,26.8 42.93,26.8 | 42.93,26.8 D6.2 | v43.43,28.07 43.43,27.3 42.93,26.8
SRST  (via drill 0.2)
  Top 0.19: U3.40 33.15,17.18 33.15,17.71 32.73,18.13 32.73,19.37 33.29,19.94 40.01,19.94 v42.93,22.86
  Bottom 0.19: SIM1.RST 43.07,23.54 D4.2 42.93,23.69 v42.93,22.86
SSW
  Bottom 0.19: Q5.5 39.97,22.23 R31.1 43.64,22.28 43.64,22.3 43.81,22.48 45.01,22.48 SIM1.SW
STAT
  Top 0.19: U5.4 7.85,18.89 8.21,18.89 8.76,19.45 8.76,20.12 8.51,20.37 8.51,20.7 9.02,21.21 DL2.C
SVCC  (via drill 0.2)
  Top 0.19: v36.58,19.05 36.32,19.3 35.31,19.3 34.76,18.75 34.76,17.43 U3.41
  Bottom 0.19: C32.2 45.05,17.38 SIM1.VCC 37.77,20.24 v36.58,19.05
USB_N
  Top 0.19: D-.X 16.83,8.69 R17.1 D1.3 20.64,8.7 | 20.84,8.9 20.84,9.16 20.7,9.29 20.7,24.4 arc90 17.57,27.54 U1.33 | 20.84,8.9 20.84,8.51 | 20.84,8.51 20.84,5.35 20.69,5.19 J1.2 | 20.84,8.9 20.64,8.7 | 20.84,8.51 20.65,8.7 20.64,8.7
USB_P
  Top 0.19: D+.X 25.6,8.82 R7.1 23.88,8.7 D1.2 21.38,8.7 | 21.08,9.4 | 21.08,9.4 21.18,9.3 21.18,8.89 | 21.18,8.89 21.18,8.51 | 21.18,8.51 21.18,5.2 21.34,5.05 J1.3 | 21.18,8.89 21.38,8.7 | 21.18,8.51 21.37,8.7 21.38,8.7 | U1.34 17.57,28.04 arc-90 21.04,24.56 21.04,9.44 21.08,9.4
V_BCKP
  Top 0.19: U3.2 46.48,32.26 45.09,33.66 R12.2
VBATT  (via drill 0.35)
  Top 0.254: U5.14 U5.13
  Top 0.305: U5.14 2.42,19.29
  Top 0.406: D2.C 29.81,14.05 R33.2 BATT+.X 26.29,11.56 v25.65,10.92 | 2.42,19.29 v2.41,19.3 | R8.2 v4.83,30.48
  Bottom 0.406: v25.65,10.92 21.84,7.11 4.7,7.11 3.17,8.64 3.17,18.54 v2.41,19.3 2.41,28.57 4.32,30.48 v4.83,30.48
VIN  (via drill 0.2)
  Top 0.19: Q2.A 10.02,15.44 R19.2 10.09,15.62 10.47,16 12.37,16 12.95,16.65 12.95,17.65 v12.06,18.54 | v10.67,19.81 Q2.G
  Bottom 0.19: v10.67,19.81 10.67,18.54 v12.06,18.54
VUSB1  (via drill 0.2)
  Top 0.19: U5.23 6.44,16.28 6.44,15.93 6.48,15.89 v6.48,15.37
  Bottom 0.19: D3.A 6.99,14.86 v6.48,15.37 6.48,14.57 C12.1 C13.1

## Text on the board
tNames: J6 | Leon Arpio / Ing. Electronica ITESO | IoT project board, ITESO, spring 2020 / by Leon Arpio Fernandez.